# Altium schematic sheet P10_uSD.SchDoc
size A
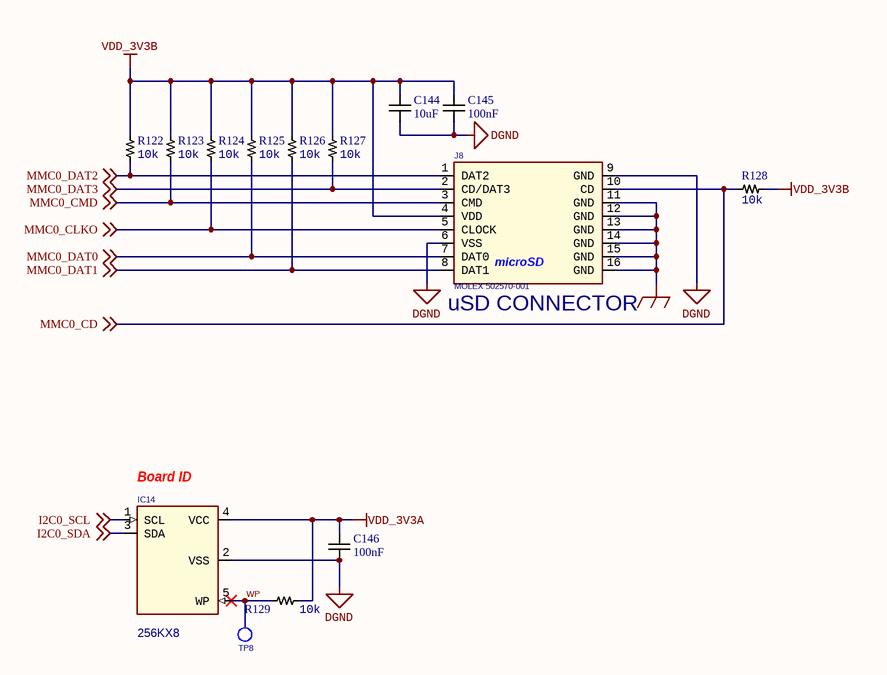
[diagram p0: P10_uSD.SchDoc]

## Parts
C144  Capacitance: 10uF  [CAP0805]  (hidden comment: C2012X6S1A106K085AC)
C145  Capacitance: 100nF  [CAP0402]  (hidden comment: C0402C104K4RACTU)
C146  Capacitance: 100nF  [CAP0402]  (hidden comment: C0402C104K4RACTU)
IC14  24LC32A  [SOT-23-5]  (value not drawn)
J8  MOLEX 502570-001  [SD-MICRO-SCHA5B0300]
R122  Resistance: 10k  [RES0402]  (hidden comment: RC0402FR-0710KL)
R123  Resistance: 10k  [RES0402]  (hidden comment: RC0402FR-0710KL)
R124  Resistance: 10k  [RES0402]  (hidden comment: RC0402FR-0710KL)
R125  Resistance: 10k  [RES0402]  (hidden comment: RC0402FR-0710KL)
R126  Resistance: 10k  [RES0402]  (hidden comment: RC0402FR-0710KL)
R127  Resistance: 10k  [RES0402]  (hidden comment: RC0402FR-0710KL)
R128  Resistance: 10k  [RES0402]  (hidden comment: RC0402FR-0710KL)
R129  Resistance: 10k  [RES0402]  (hidden comment: RC0402FR-0710KL)
TP8  TESTPT1  [tp1-8040]  (value not drawn)  (no BOM)

## Nets
DGND: C144.2 C145.2 C146.2 IC14.2(VSS) J8.6(VSS) J8.9(GND)
GND_EARTH: J8.11(GND) J8.12(GND) J8.13(GND) J8.14(GND) J8.15(GND) J8.16(GND)
VDD_3V3A: C146.1 IC14.4(VCC) R129.2
VDD_3V3B: C144.1 C145.1 J8.4(VDD) R122.2 R123.2 R124.2 R125.2 R126.2 R127.2 R128.1
I2C0_SCL: IC14.1(SCL) ; off-sheet I2C0_SCL
I2C0_SDA: IC14.3(SDA) ; off-sheet I2C0_SDA
MMC0_CD: J8.10(CD) R128.2 ; off-sheet MMC0_CD
MMC0_CLKO: J8.5(CLOCK) R124.1 ; off-sheet MMC0_CLKO
MMC0_CMD: J8.3(CMD) R123.1 ; off-sheet MMC0_CMD
MMC0_DAT0: J8.7(DAT0) R125.1 ; off-sheet MMC0_DAT0
MMC0_DAT1: J8.8(DAT1) R126.1 ; off-sheet MMC0_DAT1
MMC0_DAT2: J8.1(DAT2) R122.1 ; off-sheet MMC0_DAT2
MMC0_DAT3: J8.2(CD/DAT3) R127.1 ; off-sheet MMC0_DAT3
WP: IC14.5(WP) R129.1 TP8.1(TP)

## Notes on the sheet
- (near J8) uSD CONNECTOR
- (near IC14) Board ID
- (near IC14) 256KX8
- (in symbol microSD_CONN_2) microSD

## Library data of the parts
C144 = CAP_10uF: MLCC 10uF 0805 SMD; Manufacturer: TDK; Tolerance: 10%; Dielectric Material: Ceramic; Voltage Rating: 10V; Dielectric: X6S; Manufacturer Part Number: C2012X6S1A106K085AC; Packaging: Tape and Reel; Pricing 1: 1=0.30000, 10=0.20500, 100=0.11610, 500=0.08198, 1000=0.07173 (USD); RoHS: Yes; Stock 1: 46852; Supplier 1: Digi-Key; Supplier Part Number 1: 445-7613-1-ND; Mount: Surface Mount; Case/Package: 0805; Weight: 0.000194oz; Case Code (Metric): 2012; Case Code (Imperial): 0805; Min Operating Temperature: -55°C; Max Operating Temperature: 105°C; Termination: SMD/SMT; Package Quantity: 4000; Voltage Rating (DC): 10V; Composition: Ceramic; Length: 2mm; Height: 1.25mm; Depth: 1.25mm; Width: 0.049inch; Thickness: 0.037inch; REACH SVHC: No SVHC; Lead Free: Lead Free; ComponentLink3URL: https://datasheet.ciiva.com/6290/tdkmlcccaprange-6290501.pdf?src-supplier=Digi-Key; ComponentLink3Description: Datasheet
C145 C146 = CAP_100nF: MLCC 100nF 0402 SMD; Manufacturer: KEMET; Tolerance: 10%; Voltage Rating (DC): 16V; Dielectric: X7R; Dissipation Factor: 3.5%; Supplier 1: Digi-Key; Supplier Part Number 1: 399-3521-1-ND; Manufacturer Part Number: C0402C104K4RACTU; RoHS: Yes; Stock 1: 6512243; Pricing 1: 1=0.10000, 10=0.04200, 100=0.01860, 500=0.01328, 1000=0.01044, 2500=0.00949, 5000=0.00873 (USD); Packaging: Tape and Reel; Mount: Surface Mount; Case/Package: 0402; Case Code (Imperial): 0402; Case Code (Metric): 1005; Contact Plating: Tin,Matte; Min Operating Temperature: -55°C; Max Operating Temperature: 125°C; Package Quantity: 10000; Voltage Rating: 16V; Termination: SMD/SMT; Length: 1mm; Height: 0.5mm; Width: 0.5mm; Depth: 0.5mm; Radiation Hardening: No; ComponentLink2URL: https://datasheet.ciiva.com/18192/getdatasheetpartid-385384-18192412.pdf?src-supplier=Verical; ComponentLink2Description: Datasheet
IC14 = 24LC32A: IC EEPROM 32KBIT 400KHZ SOT23-5; Manufacturer: Microchip Technology; Manufacturer Part Number: 24LC32AT-I/OT; Format - Memory: EEPROMs - Serial; Memory Size: 32K (4K x 8); Interface: I²C, 2-Wire Serial; Voltage - Supply: 2.5 V ~ 5.5 V; Supplier 1: Digi-Key; Supplier Part Number 1: 24LC32AT-I/OTDKR-ND; RoHS: RoHS Compliant; Category: Integrated Circuits (ICs); Stock 1: 8694; Pricing 1: 1=0.5, 10=0.32, 25=0.31, 100=0.3 (USD); Memory Type: EEPROM; Speed: 400kHz; Operating Temperature: -40°C ~ 85°C; Package / Case: SC-74A, SOT-753; Supplier Device Package: SOT-23-5; Packaging: Digi-Reel®; ComponentLink1URL: http://ww1.microchip.com/downloads/en/DeviceDoc/21713M.pdf; ComponentLink1Description: http://ww1.microchip.com/downloads/en/DeviceDoc/21713M.pdf
J8 = microSD_CONN_2: CONN MICRO SD R/A PUSH-PUSH SMD; Manufacturer: Molex Inc; Manufacturer Part Number: 5025700893; Card Type: Secure Digital - microSD™ TransFlash; Number of Positions: 10 (8 + 2); Connector Type: Connector and Ejector; Insertion, Removal Method: Push In, Push Out; Supplier 1: Digi-Key; Supplier Part Number 1: WM19093TR-ND; RoHS: RoHS Compliant; Category: Connectors, Interconnects; Stock 1: 16900; Pricing 1: 1300=2.16645, 2600=2.01703, 6500=1.94233 (USD); Ejector Side: -; Mounting Type: Surface Mount, Right Angle; Features: Switch; Height Above Board: 0.071" (1.80mm); Mounting Feature: Normal, Standard - Top; Packaging: Tape & Reel (TR); Contact Finish: Gold; Contact Finish Thickness: 20µin (0.51µm); ComponentLink1URL: http://www.molex.com/pdm_docs/sd/5025700893_sd.pdf; ComponentLink1Description: http://www.molex.com/pdm_docs/sd/5025700893_sd.pdf
R122-R129 = RES_10k: Resistor 10kOhm 0402 SMD; Manufacturer: Yageo; Temperature Coefficient: 100ppm/°C; Tolerance: 1%; Voltage Rating (DC): 50V; Power Rating: 62.5mW; ComponentLink1Description: https://datasheet.ciiva.com/7660/38568-7660787.pdf?src-supplier=Element14; ComponentLink1URL: https://datasheet.ciiva.com/7660/38568-7660787.pdf?src-supplier=Element14; Composition: Thick Film; Height: 0.32mm; Manufacturer Part Number: RC0402FR-0710KL; Number of Terminations: 2; Packaging: Tape and Reel; Pricing 1: 1=0.10000, 10=0.01500, 100=0.00600, 1000=0.00270, 2500=0.00235, 5000=0.00194 (USD); RoHS: Yes; Stock 1: 72891652; Supplier 1: Digi-Key; Case/Package: 0402; Number of Pins: 2; Case Code (Imperial): 0402; Case Code (Metric): 1005; Min Operating Temperature: -55°C; Max Operating Temperature: 155°C; Voltage Rating: 50V; Termination: SMD/SMT; Military Standard: Not; Working Voltage: 50V; Length: 1mm; Width: 0.5mm; Depth: 0.5mm; Lead Pitch: 0.2mm; REACH SVHC: No SVHC; Lead Free: Lead Free; ComponentLink2URL: https://datasheet.ciiva.com/7983/1018594-7983486.pdf?src-supplier=Element14; ComponentLink2Description: https://datasheet.ciiva.com/7983/1018594-7983486.pdf?src-supplier=Element14; ComponentLink3URL: https://datasheet.ciiva.com/7849/1784430-7849813.pdf?src-supplier=Element14; ComponentLink3Description: https://datasheet.ciiva.com/7849/1784430-7849813.pdf?src-supplier=Element14; ComponentLink4URL: https://datasheet.ciiva.com/7849/1686128-7849814.pdf?src-supplier=Element14; ComponentLink4Description: https://datasheet.ciiva.com/7849/1686128-7849814.pdf?src-supplier=Element14; ComponentLink5URL: https://datasheet.ciiva.com/7849/1784430-7849815.pdf?src-supplier=Element14; ComponentLink5Description: https://datasheet.ciiva.com/7849/1784430-7849815.pdf?src-supplier=Element14; ComponentLink6URL: https://datasheet.ciiva.com/22747/1018594-22747512.pdf?src-supplier=Element14; ComponentLink6Description: https://datasheet.ciiva.com/22747/1018594-22747512.pdf?src-supplier=Element14; ComponentLink7URL: https://datasheet.ciiva.com/12667/pyu-rc0402-51-rohs-l-6-r-12667067.pdf?src-supplier=Mouser; ComponentLink7Description: https://datasheet.ciiva.com/12667/pyu-rc0402-51-rohs-l-6-r-12667067.pdf?src-supplier=Mouser